# Altium project AudioBox_DAC.PrjPcb
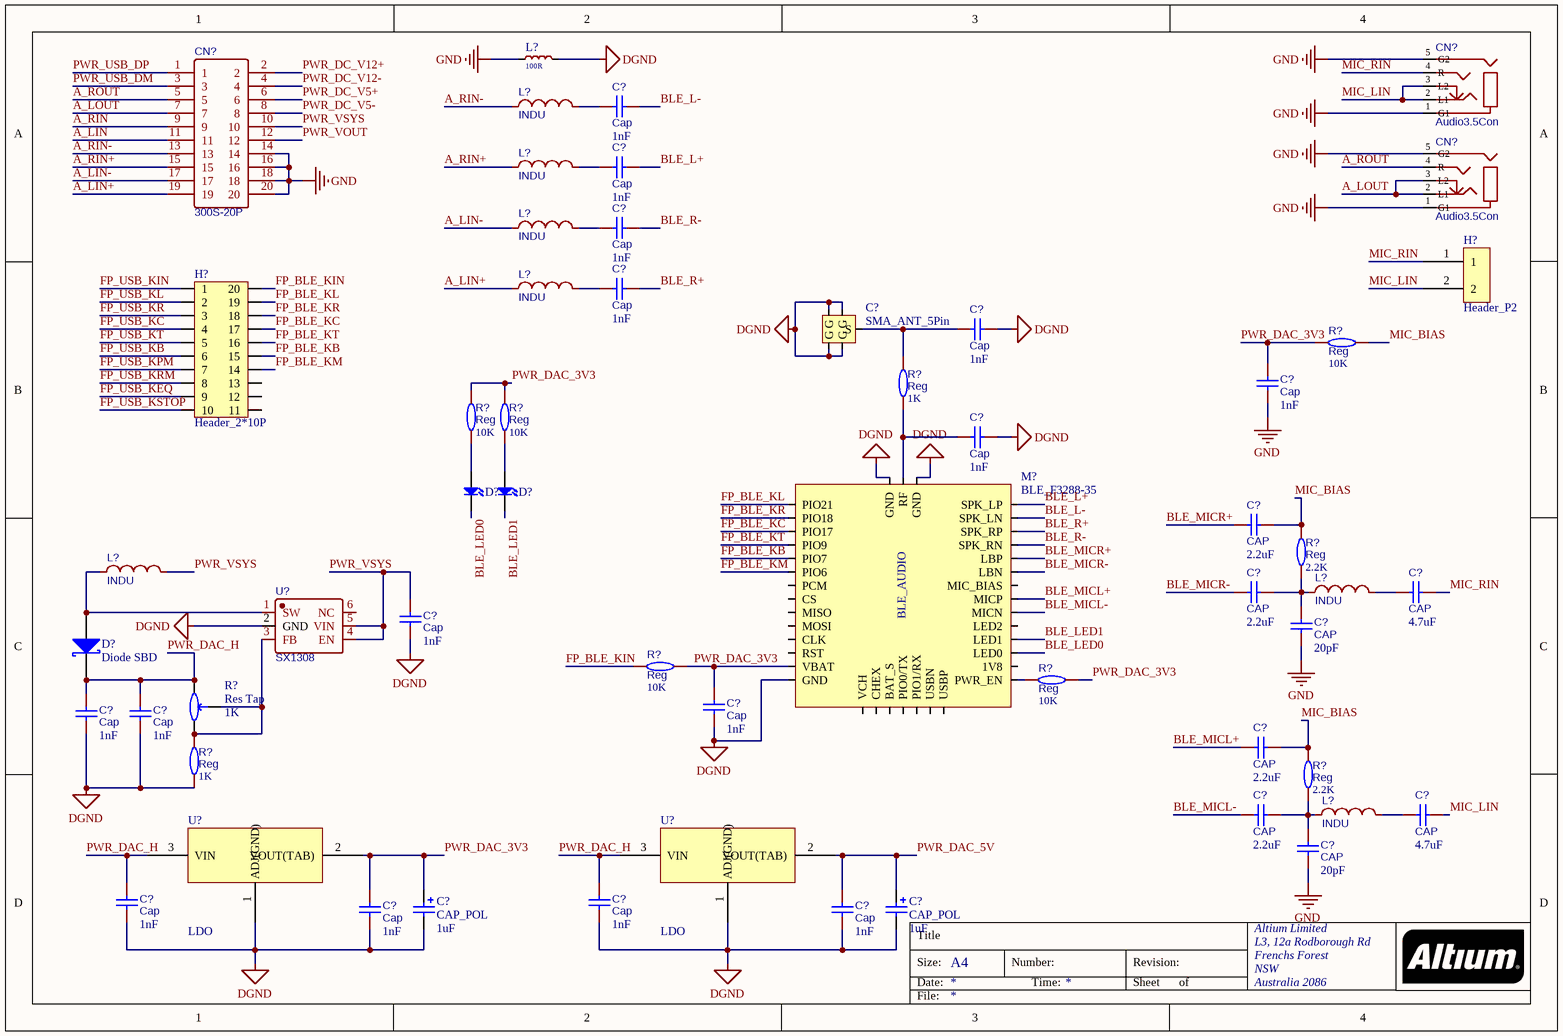
[diagram p0: BLE.SchDoc]
2 sheets, 116 parts. Net scope: global (net labels, ports and power ports of the same name join across sheets).
Sheets:
  BLE.SchDoc
  USB.SchDoc

## Sheet BLE.SchDoc
size A4; Organization: Altium Limited; Address1: L3, 12a Rodborough Rd; Address2: Frenchs Forest; Address3: NSW; Address4: Australia 2086

### Parts
(Parts that share a designator on the sheet are numbered #1, #2 ... from top to bottom, then left to right.)
C?#1  Cap  value 1nF  [C0603]
C?#2  Cap  value 1nF  [C0603]
C?#3  Cap  value 1nF  [C0603]
C?#4  Cap  value 1nF  [C0603]
C?#5  SMA_ANT_5Pin
C?#6  Cap  value 1nF  [C0603]
C?#7  Cap  value 1nF  [C0603]
C?#8  Cap  value 1nF  [C0603]
C?#9  CAP  value 2.2uF  [C0603]
C?#10  CAP  value 2.2uF  [C0603]
C?#11  CAP  value 4.7uF  [C0603]
C?#12  Cap  value 1nF  [C0603]
C?#13  CAP  value 20pF  [C0603]
C?#14  Cap  value 1nF  [C0603]
C?#15  Cap  value 1nF  [C0603]
C?#16  Cap  value 1nF  [C0603]
C?#17  CAP  value 2.2uF  [C0603]
C?#18  CAP  value 2.2uF  [C0603]
C?#19  CAP  value 4.7uF  [C0603]
C?#20  CAP  value 20pF  [C0603]
C?#21  Cap  value 1nF  [C0603]
C?#22  Cap  value 1nF  [C0603]
C?#23  Cap  value 1nF  [C0603]
C?#24  CAP_POL  value 1uF  [CAP_SMD_10mm]
C?#25  Cap  value 1nF  [C0603]
C?#26  CAP_POL  value 1uF  [CAP_SMD_10mm]
CN?#1  Audio3.5Con  [Audio3.5_3Pin]
CN?#2  300S-20P  [DC_20P_2.54]
CN?#3  Audio3.5Con  [Audio3.5_3Pin]
D?#1  LED  [LED0603]  (value not drawn)
D?#2  LED  [LED0603]  (value not drawn)
D?#3  Diode SBD  [SMA_L4.3]
H?#1  Header_P2  [H_1.27_P2]
H?#2  Header_2*10P  [H_2.0_2x10Pin_SMD]
L?#1  value 100R  [L0603]  (hidden comment: 电感磁珠)
L?#2  INDU  [SMD_L7.1]
L?#3  INDU  [SMD_L7.1]
L?#4  INDU  [SMD_L7.1]
L?#5  INDU  [SMD_L7.1]
L?#6  INDU  [SMD_L7.1]
L?#7  INDU  [SMD_L7.1]
L?#8  INDU  [SMD_L7.1]
M?  BLE_F3288-35
R?#1  Reg  value 10K  [R0603]
R?#2  Reg  value 1K  [R0603]
R?#3  Reg  value 10K  [R0603]
R?#4  Reg  value 10K  [R0603]
R?#5  Reg  value 2.2K  [R0603]
R?#6  Reg  value 10K  [R0603]
R?#7  Reg  value 10K  [R0603]
R?#8  Res Tap  value 1K  [Res_Tap_3296]
R?#9  Reg  value 1K  [R0603]
R?#10  Reg  value 2.2K  [R0603]
U?#1  SX1308  [SOT-23-6]
U?#2  LDO  [SOT-89]
U?#3  LDO  [SOT-89]

### Nets
DGND: C?#5.1(G) C?#5.2(G) C?#5.3(G) C?#5.4(G) C?#6.2 C?#8.2 C?#12.2 C?#14.2 C?#15.2 C?#16.2 C?#21.2 C?#22.2 C?#23.2 C?#24.2 C?#25.2 C?#26.2 L?#1.2 M?.14(GND) M?.36(GND) M?.38(GND) R?#9.1 U?#1.2(GND) U?#2.1(ADJ(GND)) U?#3.1(ADJ(GND))
GND: C?#7.1 C?#13.1 C?#20.1 CN?#1.1(G1) CN?#1.5(G2) CN?#2.14 CN?#2.16 CN?#2.18 CN?#2.20 CN?#3.1(G1) CN?#3.5(G2) L?#1.1
A_LIN: CN?#2.11
A_LIN+: CN?#2.19 L?#5.1
A_LIN-: CN?#2.17 L?#4.1
A_LOUT: CN?#2.7 CN?#3.2(L1) CN?#3.3(L2)
A_RIN: CN?#2.9
A_RIN+: CN?#2.15 L?#3.1
A_RIN-: CN?#2.13 L?#2.1
A_ROUT: CN?#2.5 CN?#3.4(R)
BLE_L+: C?#2.2 M?.35(SPK_LP)
BLE_L-: C?#1.2 M?.34(SPK_LN)
BLE_LED0: D?#1.1(K) M?.24(LED0)
BLE_LED1: D?#2.1(K) M?.25(LED1)
BLE_MICL+: C?#17.2 M?.28(MICP)
BLE_MICL-: C?#18.2 M?.27(MICN)
BLE_MICR+: C?#9.2 M?.31(LBP)
BLE_MICR-: C?#10.2 M?.30(LBN)
BLE_R+: C?#4.2 M?.33(SPK_RP)
BLE_R-: C?#3.2 M?.32(SPK_RN)
FP_BLE_KB: H?#2.15 M?.5(PIO7)
FP_BLE_KC: H?#2.17 M?.3(PIO17)
FP_BLE_KIN: H?#2.20 R?#6.2
FP_BLE_KL: H?#2.19 M?.1(PIO21)
FP_BLE_KM: H?#2.14 M?.6(PIO6)
FP_BLE_KR: H?#2.18 M?.2(PIO18)
FP_BLE_KT: H?#2.16 M?.4(PIO9)
FP_USB_KB: H?#2.6
FP_USB_KC: H?#2.4
FP_USB_KEQ: H?#2.9
FP_USB_KIN: H?#2.1
FP_USB_KL: H?#2.2
FP_USB_KPM: H?#2.7
FP_USB_KR: H?#2.3
FP_USB_KRM: H?#2.8
FP_USB_KSTOP: H?#2.10
FP_USB_KT: H?#2.5
MIC_BIAS: C?#9.1 C?#17.1 R?#1.1 R?#5.2 R?#10.2
MIC_LIN: C?#19.1 CN?#1.2(L1) CN?#1.3(L2) H?#1.2
MIC_RIN: C?#11.1 CN?#1.4(R) H?#1.1
PWR_DAC_3V3: C?#7.2 C?#14.1 C?#23.1 C?#24.1 M?.13(VBAT) R?#1.2 R?#3.2 R?#4.1 R?#6.1 R?#7.1 U?#2.2(VOUT(TAB))
PWR_DAC_5V: C?#25.1 C?#26.1 U?#3.2(VOUT(TAB))
PWR_DAC_H: C?#15.1 C?#16.1 C?#21.1 C?#22.1 D?#3.1(K) R?#8.1(A) U?#2.3(VIN) U?#3.3(VIN)
PWR_DC_V5+: CN?#2.6
PWR_DC_V5-: CN?#2.8
PWR_DC_V12+: CN?#2.2
PWR_DC_V12-: CN?#2.4
PWR_USB_DM: CN?#2.3
PWR_USB_DP: CN?#2.1
PWR_VOUT: CN?#2.12
PWR_VSYS: C?#12.1 CN?#2.10 L?#6.2 U?#1.4(EN) U?#1.5(VIN)
NetC?#1_1: C?#1.1 L?#2.2
NetC?#2_1: C?#2.1 L?#3.2
NetC?#3_1: C?#3.1 L?#4.2
NetC?#4_1: C?#4.1 L?#5.2
NetC?#5_5: C?#5.5(S) C?#6.1 R?#2.2
NetC?#8_1: C?#8.1 M?.37(RF) R?#2.1
NetC?#10_1: C?#10.1 C?#13.2 L?#7.1 R?#5.1
NetC?#11_2: C?#11.2 L?#7.2
NetC?#18_1: C?#18.1 C?#20.2 L?#8.1 R?#10.1
NetC?#19_2: C?#19.2 L?#8.2
NetD?#1_2: D?#1.2(A) R?#3.1
NetD?#2_2: D?#2.2(A) R?#4.2
NetD?#3_2: D?#3.2(A) L?#6.1 U?#1.1(SW)
NetM?_22: M?.22(PWR_EN) R?#7.2
NetR?#8_2: R?#8.2(B) R?#8.3(TAP) R?#9.2 U?#1.3(FB)

Not connected (* = marked no-connect by the designer): H?#2 11 12 13; M? 7(PCM) 8(CS) 9(MISO) 10(MOSI) 11(CLK) 12(RST) 15(VCH) 16(CHEX) 17(BAT_S) 18(PIO0/TX) 19(PIO1/RX) 20(USBN) 21(USBP) 23(1V8) 26(LED2) 29(MIC_BIAS); U?#1 6(NC)

### Notes on the sheet
- Title
- Size:
- Date:
- A4
- Number:
- Time:
- Revision:
- Sheet
- of
- File:
- (in symbol BLE_F3288-35) BLE_AUDIO

### Library data of the parts
C?#1-C?#4 C?#6-C?#23 C?#25 = CAP: BOM_Manufacturer: Huaxin S&T; BOM_Manufacturer Part: 0603B103K101CT; nameAlias: Capacitance; Contributor: LCSC; BOM_Supplier: LCSC; BOM_Supplier Part: C302008; spicePre: C; spiceSymbolName: 0603B103K101CT
C?#5 = SMA_ANT_5Pin: SMA射频天线座
C?#24 C?#26 = CAP_POL: 极性电容
CN?#1 CN?#3 = AudioCon3: 3.5mm 3Pin 音频接口; BOM_Manufacturer: G-Switch(品赞); BOM_Manufacturer Part: PJ-393; Contributor: LCSC; BOM_Supplier: LCSC; BOM_Supplier Part: C2837065; BOM_JLCPCB Part Class: Extended Part; spicePre: C; spiceSymbolName: PJ-393_C2837065
CN?#2 = DC-20P: DC牛角座，20P; BOM_Manufacturer: Shenzhen Cankemeng; Contributor: LCSC; BOM_Supplier: LCSC; BOM_Supplier Part: C132442; BOM_Manufacturer Part: -; BOM_JLCPCB Part Class: Extended Part; spicePre: C; spiceSymbolName: 300S-20P
D?#1 D?#2 = LED0: Published: 8-Jun-2000; LatestRevisionDate: 08-Jul-2005; LatestRevisionNote: Mech Layer 1 removed.; PackageReference: LED-0; Publisher: Altium Limited; PackageDescription: LED; 2 Leads
D?#3 = Diode SBD: Schottky Rectifier; Note: Terminal 2 is the TAB and is electrically connected to the cathode; Published: 8-Jun-2000; LatestRevisionDate: 17-Jul-2002; LatestRevisionNote: Re-released for DXP Platform.; DatasheetVersion: PD-2.057B; PackageVersion: Feb-1998; PackageReference: TO-220AC; Publisher: Altium Limited; PackageDescription: TO, Thru-Hole, Vertical, Heatsink Mounted; 3 In-Line Leads (1 Absent); Pitch 2.54 mm; ComponentLink1Description: Manufacturer Link; ComponentLink1URL: http://www.irf.com/; ComponentLink2Description: Datasheet; ComponentLink2URL: http://www.irf.com/product-info/datasheets/data/10tq.pdf
H?#1 = Header_P2: 2Pin排针
H?#2 = Header_2*10P: 2*10P连接器
L?#1 = IND_FB
L?#2-L?#8 = IND: 电感; BOM_Manufacturer: Sunltech Tech; BOM_Manufacturer Part: SLO0630H150MTT; nameAlias: Inductance; Contributor: LCSC; BOM_Supplier: LCSC; BOM_Supplier Part: C182182; BOM_JLCPCB Part Class: Extended Part; spicePre: L; spiceSymbolName: SLO0630H150MTT; Value: *
M? = BLE_F3288-35: 蓝牙音频
R?#1-R?#7 R?#9 R?#10 = Res: 电阻; BOM_Manufacturer: Viking Tech; BOM_Manufacturer Part: AR03BTCX1002A; nameAlias: Resistance (Ohms); Contributor: LCSC; BOM_Supplier: LCSC; BOM_Supplier Part: C465721; spicePre: R; spiceSymbolName: AR03BTCX1002A
R?#8 = Res Tap: 可调电阻; Sim Note: Enter the Resistance value and the set point into parameter fields.; Set Position: 0.5; Published: 24-Mar-1999; LatestRevisionDate: 17-Jul-2002; LatestRevisionNote: Re-released for DXP Platform.; PackageReference: VR3; Publisher: Altium Limited; PackageDescription: Variable Resistor, Thru-Hole; 3 Leads
U?#1 = SX1308: 升压PWM; BOM_Manufacturer: SX; sourceId: g4Yg9rJ1j; timeStamp: 1472247539; BOM_Supplier: LCSC; BOM_Manufacturer Part: SX1308; BOM_Supplier Part: C78162; BOM_JLCPCB Part Class: Extended Part; spicePre: U; spiceSymbolName: SX1308
U?#2 U?#3 = AMS1117

## Sheet USB.SchDoc
size A4; Organization: Altium Limited; Address1: L3, 12a Rodborough Rd; Address2: Frenchs Forest; Address3: NSW; Address4: Australia 2086
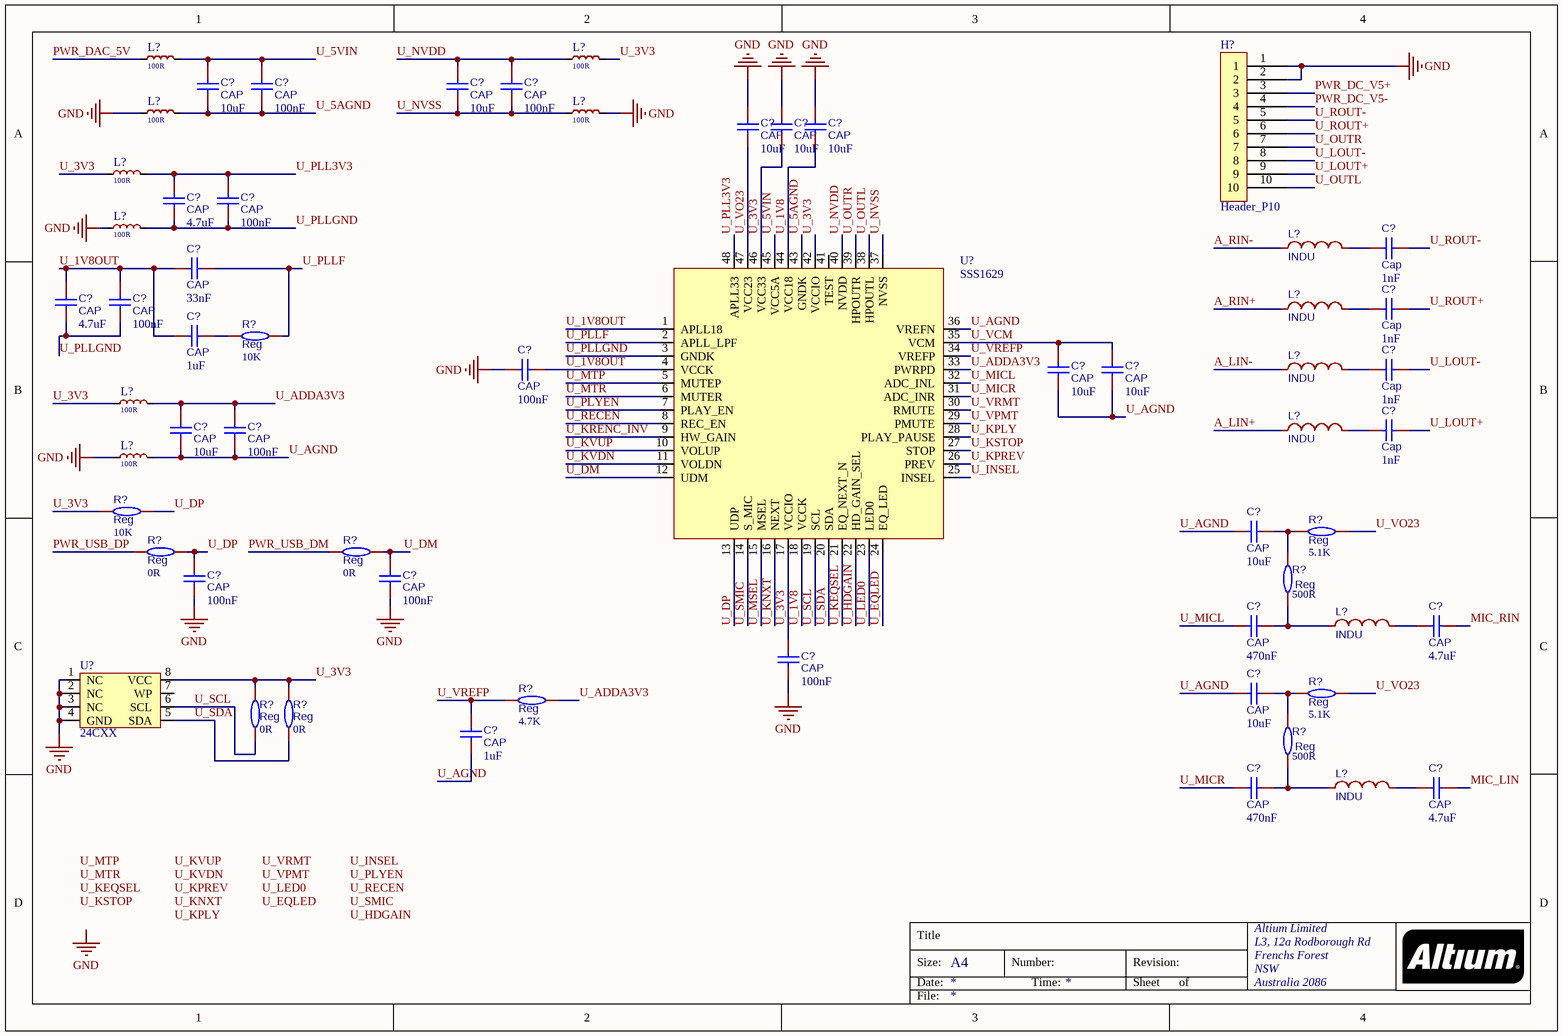
[diagram p1: USB.SchDoc]

### Parts
(Parts that share a designator on the sheet are numbered #1, #2 ... from top to bottom, then left to right.)
C?#27  CAP  value 10uF  [C0603]
C?#28  CAP  value 100nF  [C0603]
C?#29  CAP  value 10uF  [C0603]
C?#30  CAP  value 100nF  [C0603]
C?#31  CAP  value 10uF  [C0603]
C?#32  CAP  value 10uF  [C0603]
C?#33  CAP  value 10uF  [C0603]
C?#34  CAP  value 4.7uF  [C0603]
C?#35  CAP  value 100nF  [C0603]
C?#36  Cap  value 1nF  [C0603]
C?#37  CAP  value 33nF  [C0603]
C?#38  CAP  value 4.7uF  [C0603]
C?#39  CAP  value 100nF  [C0603]
C?#40  Cap  value 1nF  [C0603]
C?#41  CAP  value 1uF  [C0603]
C?#42  CAP  value 100nF  [C0603]
C?#43  CAP  value 10uF  [C0603]
C?#44  CAP  value 10uF  [C0603]
C?#45  Cap  value 1nF  [C0603]
C?#46  CAP  value 10uF  [C0603]
C?#47  CAP  value 100nF  [C0603]
C?#48  Cap  value 1nF  [C0603]
C?#49  CAP  value 10uF  [C0603]
C?#50  CAP  value 100nF  [C0603]
C?#51  CAP  value 100nF  [C0603]
C?#52  CAP  value 470nF  [C0603]
C?#53  CAP  value 4.7uF  [C0603]
C?#54  CAP  value 100nF  [C0603]
C?#55  CAP  value 10uF  [C0603]
C?#56  CAP  value 1uF  [C0603]
C?#57  CAP  value 470nF  [C0603]
C?#58  CAP  value 4.7uF  [C0603]
H?#3  Header_P10  [H_2.54_P10]
L?#9  value 100R  [L0603]  (hidden comment: 电感磁珠)
L?#10  value 100R  [L0603]  (hidden comment: 电感磁珠)
L?#11  value 100R  [L0603]  (hidden comment: 电感磁珠)
L?#12  value 100R  [L0603]  (hidden comment: 电感磁珠)
L?#13  value 100R  [L0603]  (hidden comment: 电感磁珠)
L?#14  value 100R  [L0603]  (hidden comment: 电感磁珠)
L?#15  INDU  [SMD_L7.1]
L?#16  INDU  [SMD_L7.1]
L?#17  INDU  [SMD_L7.1]
L?#18  value 100R  [L0603]  (hidden comment: 电感磁珠)
L?#19  INDU  [SMD_L7.1]
L?#20  value 100R  [L0603]  (hidden comment: 电感磁珠)
L?#21  INDU  [SMD_L7.1]
L?#22  INDU  [SMD_L7.1]
R?#11  Reg  value 10K  [R0603]
R?#12  Reg  value 10K  [R0603]
R?#13  Reg  value 5.1K  [R0603]
R?#14  Reg  value 0R  [R0603]
R?#15  Reg  value 0R  [R0603]
R?#16  Reg  value 500R  [R0603]
R?#17  Reg  value 5.1K  [R0603]
R?#18  Reg  value 4.7K  [R0603]
R?#19  Reg  value 0R  [R0603]
R?#20  Reg  value 0R  [R0603]
R?#21  Reg  value 500R  [R0603]
U?#4  SSS1629
U?#5  24CXX  [SOP-8]

### Nets
GND: C?#31.1 C?#32.1 C?#33.1 C?#42.1 C?#50.2 C?#51.2 C?#54.1 H?#3.1 H?#3.2 L?#11.1 L?#12.2 L?#14.1 L?#20.1 U?#5.1(NC) U?#5.2(NC) U?#5.3(NC) U?#5.4(GND)
A_LIN+: L?#19.1
A_LIN-: L?#17.1
A_RIN+: L?#16.1
A_RIN-: L?#15.1
MIC_LIN: C?#58.1
MIC_RIN: C?#53.1
PWR_DAC_5V: L?#9.1
PWR_DC_V5+: H?#3.3
PWR_DC_V5-: H?#3.4
PWR_USB_DM: R?#15.1
PWR_USB_DP: R?#14.1
U_1V8: C?#33.2 U?#4.18(VCCK) U?#4.44(VCC18)
U_1V8OUT: C?#37.1 C?#38.1 C?#39.1 C?#41.1 C?#42.2 U?#4.1(APLL18) U?#4.4(VCCK)
U_3V3: C?#32.2 C?#54.2 L?#10.2 L?#13.1 L?#18.1 R?#12.1 R?#19.2 R?#20.2 U?#4.17(VCCIO) U?#4.42(VCCIO) U?#4.46(VCC33) U?#5.8(VCC)
U_5AGND: C?#27.2 C?#28.2 L?#11.2 U?#4.43(GNDK)
U_5VIN: C?#27.1 C?#28.1 L?#9.2 U?#4.45(VCC5A)
U_ADDA3V3: C?#46.1 C?#47.1 L?#18.2 R?#18.2 U?#4.33(PWRPD)
U_AGND: C?#43.2 C?#44.2 C?#46.2 C?#47.2 C?#49.1 C?#55.1 C?#56.1 L?#20.2 U?#4.36(VREFN)
U_DM: C?#51.1 R?#15.2 U?#4.12(UDM)
U_DP: C?#50.1 R?#12.2 R?#14.2 U?#4.13(UDP)
U_EQLED: U?#4.24(EQ_LED)
U_HDGAIN: U?#4.22(HD_GAIN_SEL)
U_INSEL: U?#4.25(INSEL)
U_KEQSEL: U?#4.21(EQ_NEXT_N)
U_KNXT: U?#4.16(NEXT)
U_KPLY: U?#4.28(PLAY_PAUSE)
U_KPREV: U?#4.26(PREV)
U_KRENC_INV: U?#4.9(HW_GAIN)
U_KSTOP: U?#4.27(STOP)
U_KVDN: U?#4.11(VOLDN)
U_KVUP: U?#4.10(VOLUP)
U_LED0: U?#4.23(LED0)
U_LOUT+: C?#48.2 H?#3.9
U_LOUT-: C?#45.2 H?#3.8
U_MICL: C?#52.1 U?#4.32(ADC_INL)
U_MICR: C?#57.1 U?#4.31(ADC_INR)
U_MSEL: U?#4.15(MSEL)
U_MTP: U?#4.5(MUTEP)
U_MTR: U?#4.6(MUTER)
U_NVDD: C?#29.1 C?#30.1 L?#10.1 U?#4.40(NVDD)
U_NVSS: C?#29.2 C?#30.2 L?#12.1 U?#4.37(NVSS)
U_OUTL: H?#3.10 U?#4.38(HPOUTL)
U_OUTR: H?#3.7 U?#4.39(HPOUTR)
U_PLL3V3: C?#34.1 C?#35.1 L?#13.2 U?#4.48(APLL33)
U_PLLF: C?#37.2 R?#11.2 U?#4.2(APLL_LPF)
U_PLLGND: C?#34.2 C?#35.2 C?#38.2 C?#39.2 L?#14.2 U?#4.3(GNDK)
U_PLYEN: U?#4.7(PLAY_EN)
U_RECEN: U?#4.8(REC_EN)
U_ROUT+: C?#40.2 H?#3.6
U_ROUT-: C?#36.2 H?#3.5
U_SCL: R?#19.1 U?#4.19(SCL) U?#5.6(SCL)
U_SDA: R?#20.1 U?#4.20(SDA) U?#5.5(SDA)
U_SMIC: U?#4.14(S_MIC)
U_VCM: C?#43.1 C?#44.1 U?#4.35(VCM)
U_VO23: C?#31.2 R?#13.1 R?#17.1 U?#4.47(VCC23)
U_VPMT: U?#4.29(PMUTE)
U_VREFP: C?#56.2 R?#18.1 U?#4.34(VREFP)
U_VRMT: U?#4.30(RMUTE)
NetC?#36_1: C?#36.1 L?#15.2
NetC?#40_1: C?#40.1 L?#16.2
NetC?#41_2: C?#41.2 R?#11.1
NetC?#45_1: C?#45.1 L?#17.2
NetC?#48_1: C?#48.1 L?#19.2
NetC?#49_2: C?#49.2 R?#13.2 R?#16.1
NetC?#52_2: C?#52.2 L?#21.1 R?#16.2
NetC?#53_2: C?#53.2 L?#21.2
NetC?#55_2: C?#55.2 R?#17.2 R?#21.1
NetC?#57_2: C?#57.2 L?#22.1 R?#21.2
NetC?#58_2: C?#58.2 L?#22.2

Not connected (* = marked no-connect by the designer): U?#4 41(TEST); U?#5 7(WP)

### Notes on the sheet
- Labels drawn without touching a wire or pin: GND, U_EQLED, U_HDGAIN, U_INSEL, U_KEQSEL, U_KNXT, U_KPLY, U_KPREV, U_KSTOP, U_KVDN, U_KVUP, U_LED0, U_MTP, U_MTR, U_PLYEN, U_RECEN, U_SMIC, U_VPMT, U_VRMT
- Title
- Size:
- Date:
- A4
- Number:
- Time:
- Revision:
- Sheet
- of
- File:

### Library data of the parts
C?#27-C?#58 = CAP: as C?#1 on sheet BLE; BOM_Supplier: LCSC; BOM_Supplier Part: C302008; spicePre: C; spiceSymbolName: 0603B103K101CT
H?#3 = Header_P10: Header 10Pin
L?#9-L?#14 L?#18 L?#20 = IND_FB
L?#15-L?#17 L?#19 L?#21 L?#22 = IND: as L?#2 on sheet BLE; BOM_Supplier: LCSC; BOM_Supplier Part: C182182; BOM_JLCPCB Part Class: Extended Part; spicePre: L; spiceSymbolName: SLO0630H150MTT; Value: *
R?#11-R?#21 = Res: as R?#1 on sheet BLE; BOM_Supplier: LCSC; BOM_Supplier Part: C465721; spicePre: R; spiceSymbolName: AR03BTCX1002A
U?#4 = SSS1629: USB Audio IC
U?#5 = 24CXX: 24CXX EEPROM

## Nets that join several sheets
GND: BLE (12 pins), USB (17 pins)
A_LIN+: BLE (CN?#2.19 L?#5.1), USB (L?#19.1)
A_LIN-: BLE (CN?#2.17 L?#4.1), USB (L?#17.1)
A_RIN+: BLE (CN?#2.15 L?#3.1), USB (L?#16.1)
A_RIN-: BLE (CN?#2.13 L?#2.1), USB (L?#15.1)
MIC_LIN: BLE (C?#19.1 CN?#1.2 CN?#1.3 H?#1.2), USB (C?#58.1)
MIC_RIN: BLE (C?#11.1 CN?#1.4 H?#1.1), USB (C?#53.1)
PWR_DAC_5V: BLE (C?#25.1 C?#26.1 U?#3.2), USB (L?#9.1)
PWR_DC_V5+: BLE (CN?#2.6), USB (H?#3.3)
PWR_DC_V5-: BLE (CN?#2.8), USB (H?#3.4)
PWR_USB_DM: BLE (CN?#2.3), USB (R?#15.1)
PWR_USB_DP: BLE (CN?#2.1), USB (R?#14.1)